# Altium schematic sheet AllInOne.SchDoc: All schematics on one sheet
size A0; Author: Guillaume Volery; Organization: HEIG-VD (iAi); Address1: HES-SO; Address2: Master of Science; Address3: in Engineering; Address4: MA-CSYEI; Revision: 2017; SheetNumber: 1; SheetTotal: 1
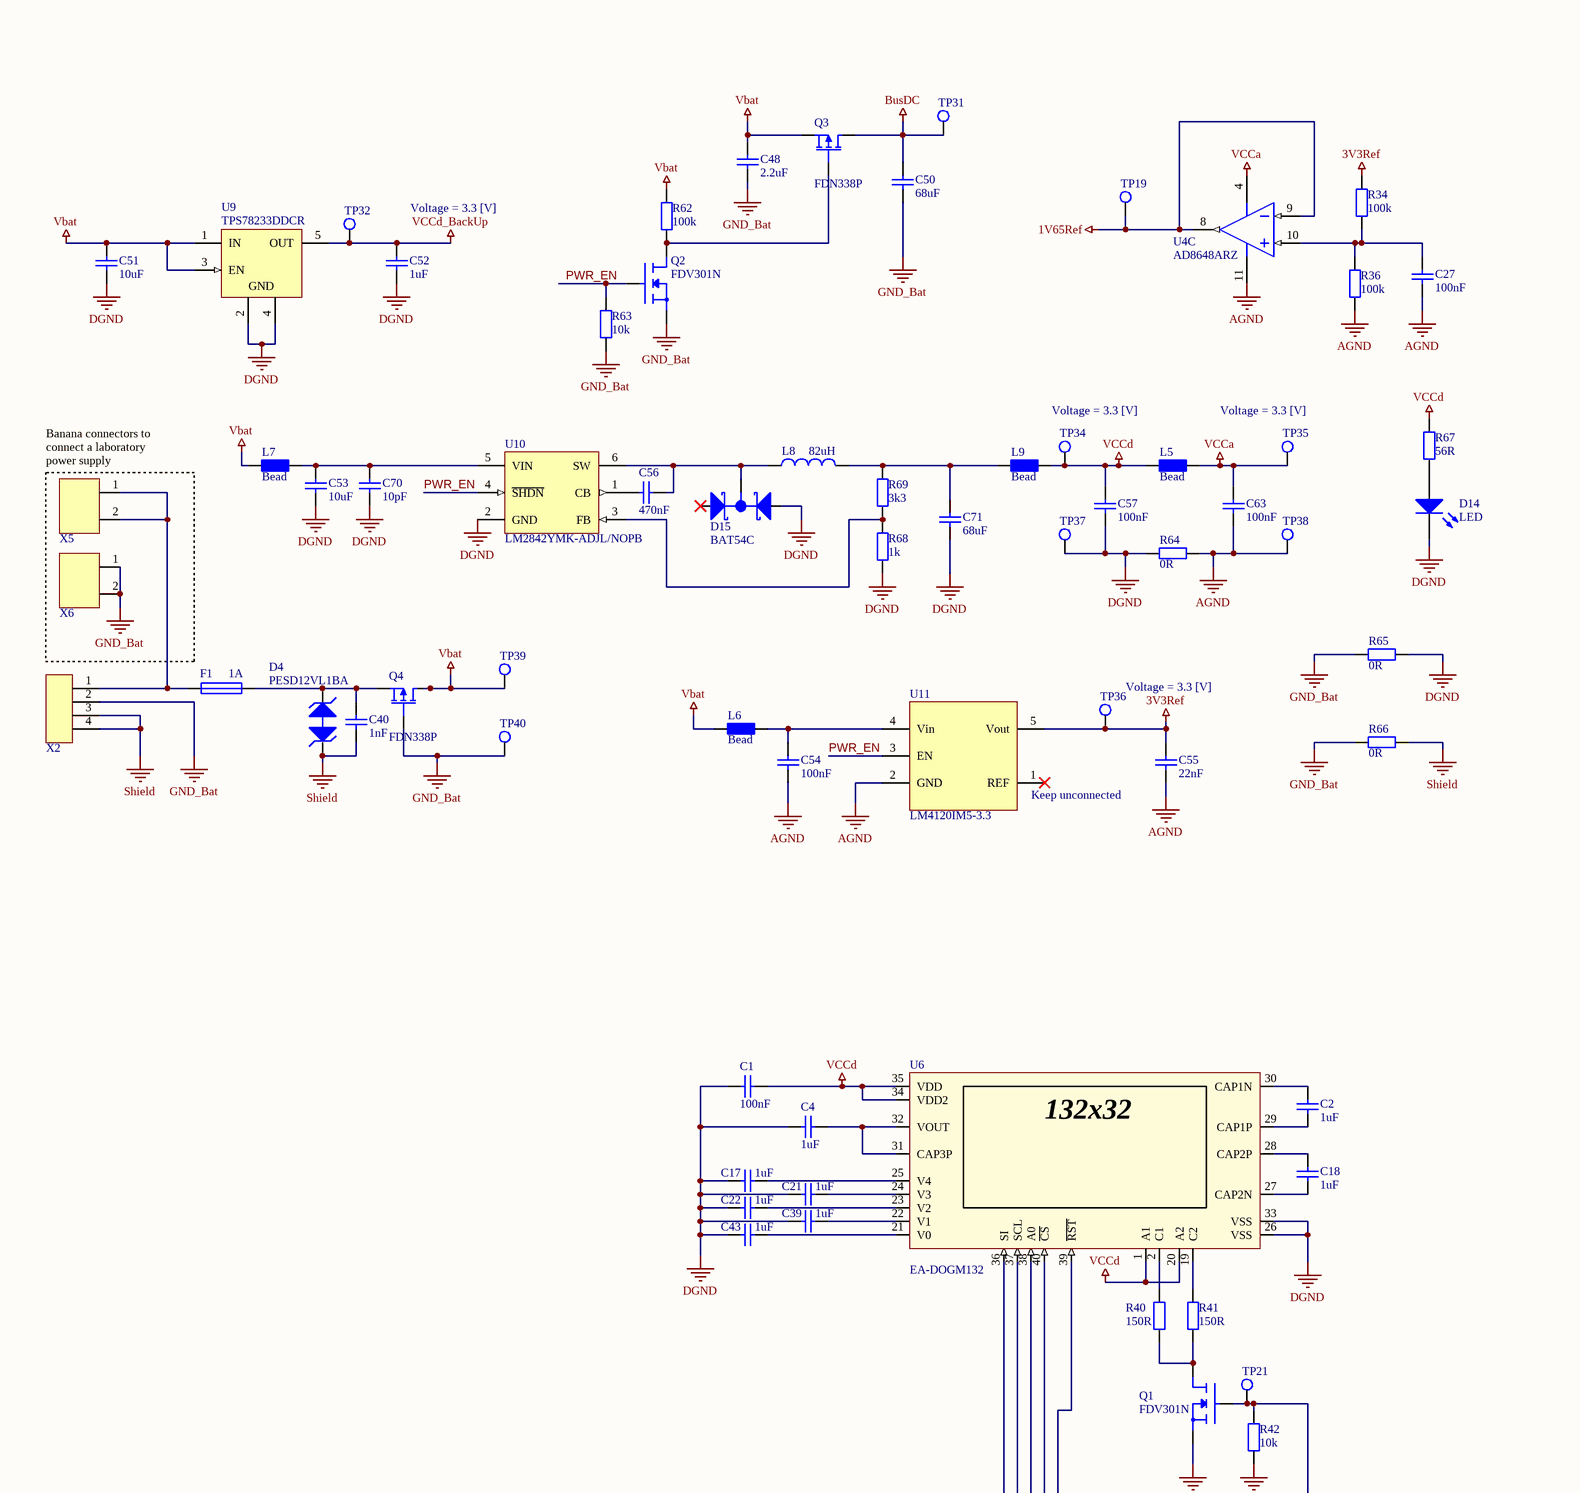
[diagram p0: AllInOne.SchDoc, top left]
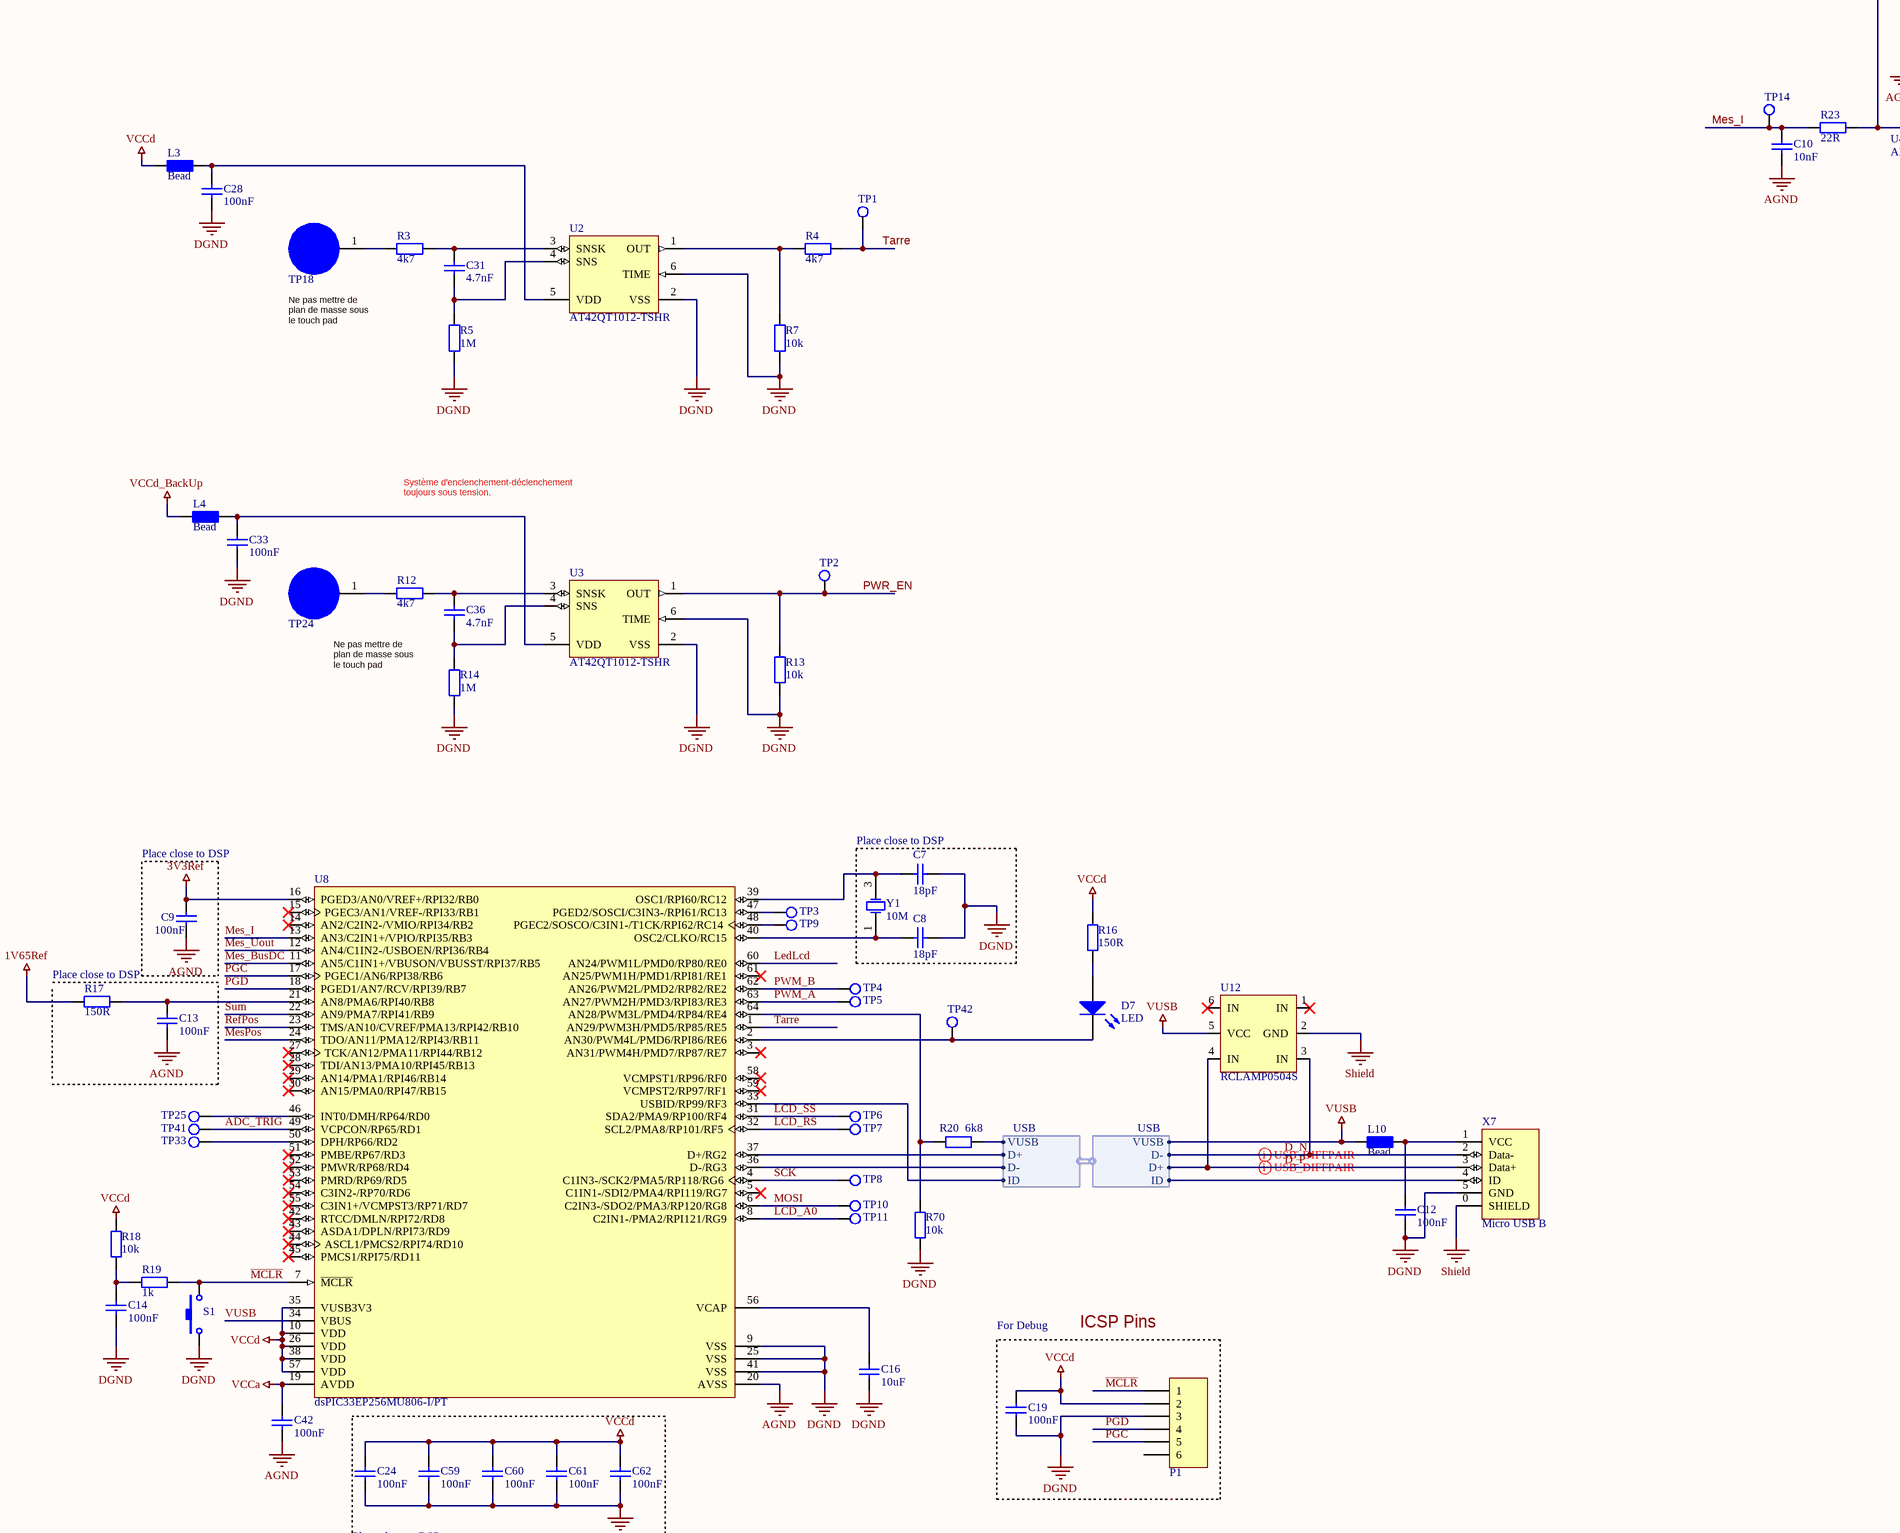
[diagram p1: AllInOne.SchDoc, top middle]
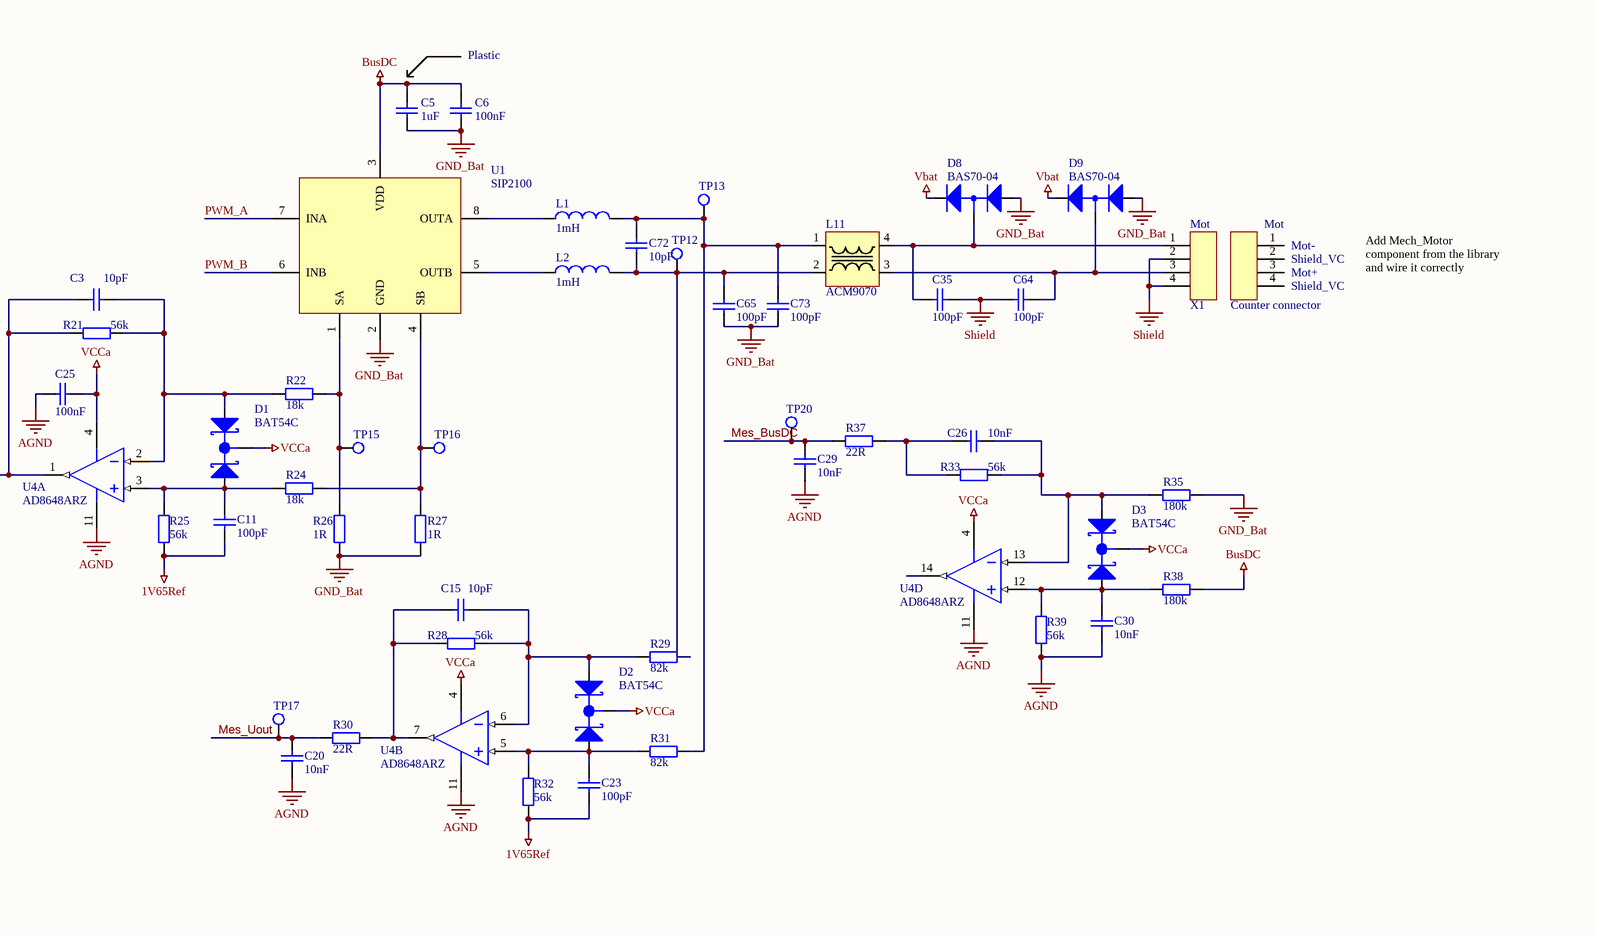
[diagram p2: AllInOne.SchDoc, top right]
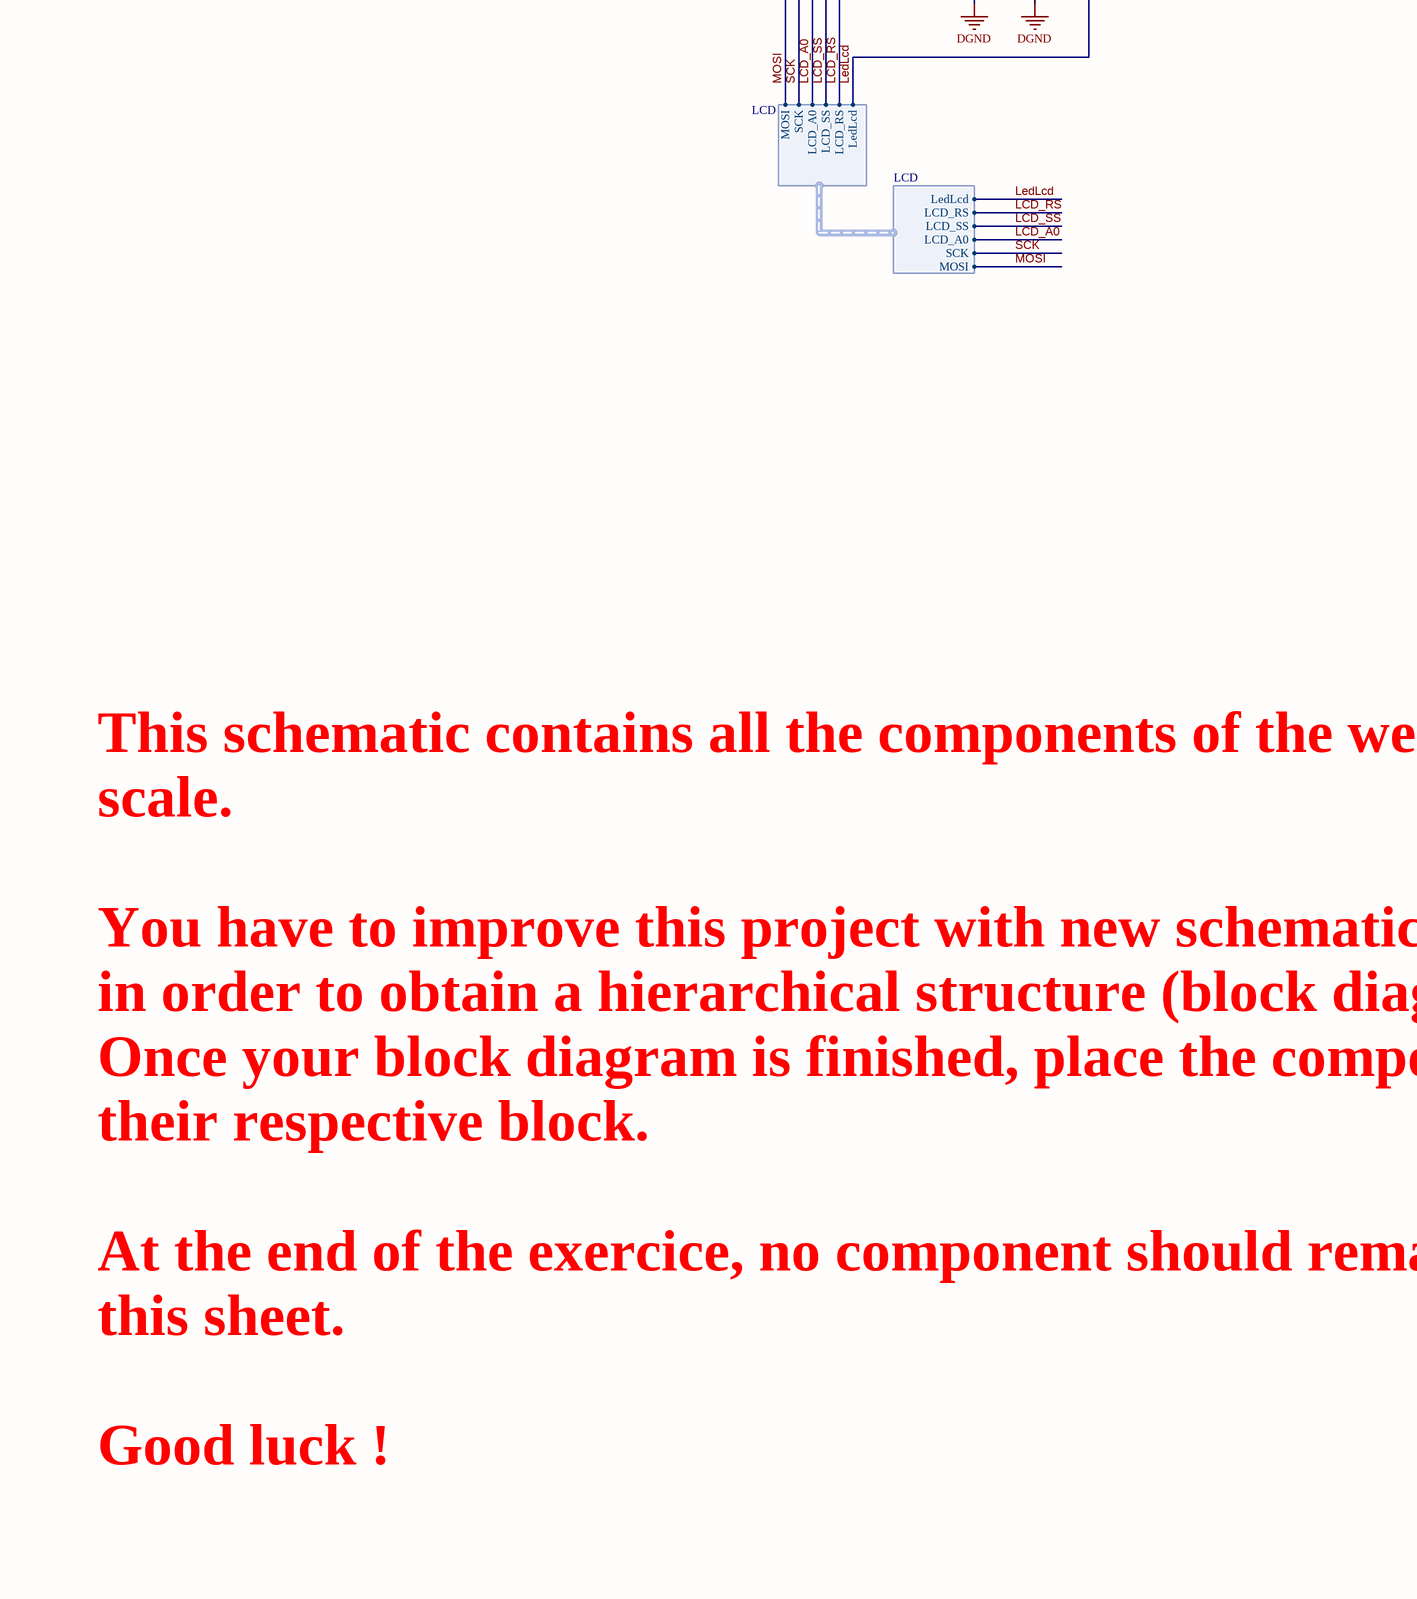
[diagram p3: AllInOne.SchDoc, bottom left]
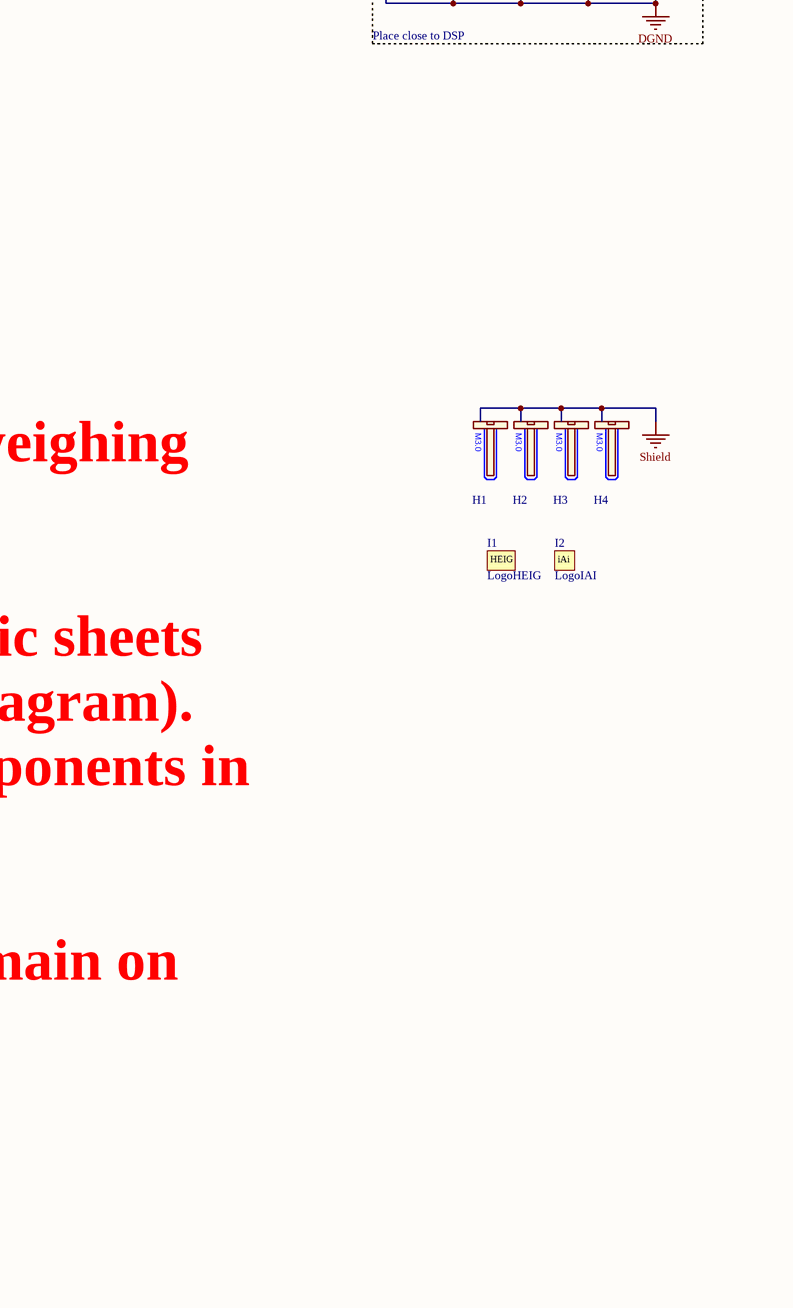
[diagram p4: AllInOne.SchDoc, bottom middle]
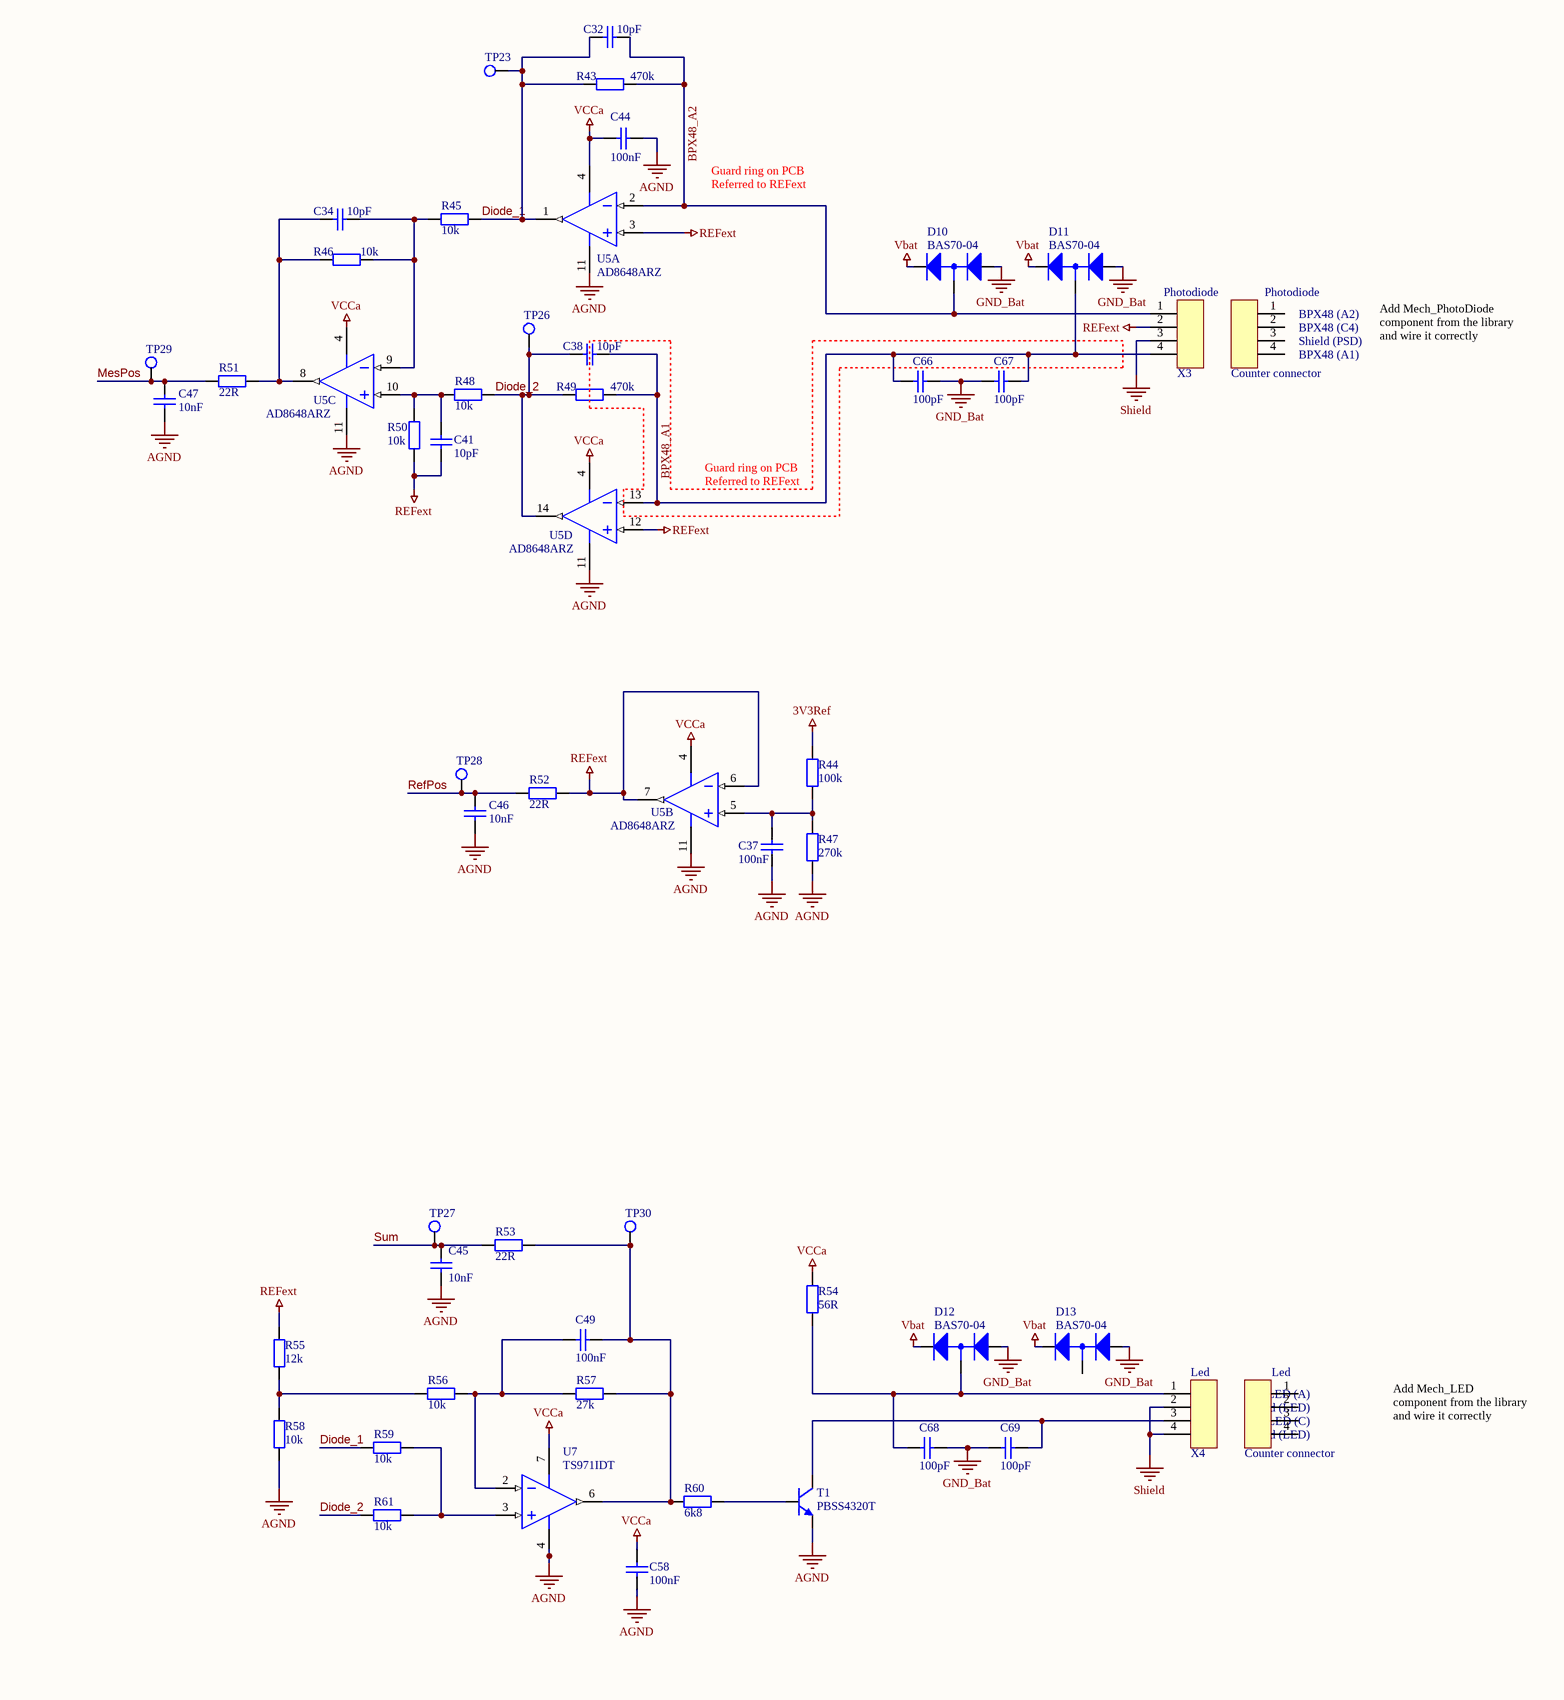
[diagram p5: AllInOne.SchDoc, bottom right]

## Parts
C1  100nF  [CAPC2012N]
C2  1uF  [CAPC2012N]
C3  10pF  [CAPC2012N]
C4  1uF  [CAPC2012N]
C5  1uF  [CAP2824]
C6  100nF  [CAPC2012N]
C7  18pF  [CAPC2012N]
C8  18pF  [CAPC2012N]
C9  100nF  [CAPC2012N]
C10  10nF  [CAPC2012N]
C11  100pF  [CAPC2012N]
C12  100nF  [CAPC2012N]
C13  100nF  [CAPC2012N]
C14  100nF  [CAPC2012N]
C15  10pF  [CAPC2012N]
C16  10uF  [CAP1206]
C17  1uF  [CAPC2012N]
C18  1uF  [CAPC2012N]
C19  100nF  [CAPC2012N]
C20  10nF  [CAPC2012N]
C21  1uF  [CAPC2012N]
C22  1uF  [CAPC2012N]
C23  100pF  [CAPC2012N]
C24  100nF  [CAPC2012N]
C25  100nF  [CAPC2012N]
C26  10nF  [CAPC2012N]
C27  100nF  [CAPC2012N]
C28  100nF  [CAPC2012N]
C29  10nF  [CAPC2012N]
C30  10nF  [CAPC2012N]
C31  4.7nF  [CAPC2012N]
C32  10pF  [CAPC2012N]
C33  100nF  [CAPC2012N]
C34  10pF  [CAPC2012N]
C35  100pF  [CAPC2012N]
C36  4.7nF  [CAPC2012N]
C37  100nF  [CAPC2012N]
C38  10pF  [CAPC2012N]
C39  1uF  [CAPC2012N]
C40  1nF  [CAPC2012N]
C41  10pF  [CAPC2012N]
C42  100nF  [CAPC2012N]
C43  1uF  [CAPC2012N]
C44  100nF  [CAPC2012N]
C45  10nF  [CAPC2012N]
C46  10nF  [CAPC2012N]
C47  10nF  [CAPC2012N]
C48  2.2uF  [CAPC2012N]
C49  100nF  [CAPC2012N]
C50  68uF  [CAP1206]
C51  10uF  [CAP1206]
C52  1uF  [CAPC2012N]
C53  10uF  [CAP1206]
C54  100nF  [CAPC2012N]
C55  22nF  [CAPC2012N]
C56  470nF  [CAPC2012N]
C57  100nF  [CAPC2012N]
C58  100nF  [CAPC2012N]
C59  100nF  [CAPC2012N]
C60  100nF  [CAPC2012N]
C61  100nF  [CAPC2012N]
C62  100nF  [CAPC2012N]
C63  100nF  [CAPC2012N]
C64  100pF  [CAPC2012N]
C65  100pF  [CAPC2012N]
C66  100pF  [CAPC2012N]
C67  100pF  [CAPC2012N]
C68  100pF  [CAPC2012N]
C69  100pF  [CAPC2012N]
C70  10pF  [CAPC2012N]
C71  68uF  [CAP1206]
C72  10pF  [CAPC2012N]
C73  100pF  [CAPC2012N]
D1  BAT54C  [SOT23-3N]
D2  BAT54C  [SOT23-3N]
D3  BAT54C  [SOT23-3N]
D4  PESD12VL1BA  [SOD323]
D7  LED  [LED2012N]
D8  BAS70-04  [SOT23-3N]
D9  BAS70-04  [SOT23-3N]
D10  BAS70-04  [SOT23-3N]
D11  BAS70-04  [SOT23-3N]
D12  BAS70-04  [SOT23-3N]
D13  BAS70-04  [SOT23-3N]
D14  LED  [LED2012N]
D15  BAT54C  [SOT23-3N]
F1  1A  [RESC2012N]
H1  Mhole M3  [MHOLE_M3.0]  (value not drawn)
H2  Mhole M3  [MHOLE_M3.0]  (value not drawn)
H3  Mhole M3  [MHOLE_M3.0]  (value not drawn)
H4  Mhole M3  [MHOLE_M3.0]  (value not drawn)
I1  LogoHEIG  [LOGO HEIG-VD_TOP/solder TOP]
I2  LogoIAI  [LOGO_IAI_TOP]
L1  1mH  [B82477G4]
L2  1mH  [B82477G4]
L3  Bead  [RESC2012N]
L4  Bead  [RESC2012N]
L5  Bead  [RESC2012N]
L6  Bead  [RESC2012N]
L7  Bead  [RESC2012N]
L8  82uH  [SRR1260A-820MC]
L9  Bead  [RESC2012N]
L10  Bead  [RESC2012N]
L11  ACM9070  [ACM9070]
P1  Connector  [HEADER_6]  (value not drawn)
Q1  FDV301N  [SOT23-3N]
Q2  FDV301N  [SOT23-3N]
Q3  FDN338P  [SOT23-3N]
Q4  FDN338P  [SOT23-3N]
R3  4k7  [RESC2012N]
R4  4k7  [RESC2012N]
R5  1M  [RESC2012N]
R7  10k  [RESC2012N]
R12  4k7  [RESC2012N]
R13  10k  [RESC2012N]
R14  1M  [RESC2012N]
R16  150R  [RESC2012N]
R17  150R  [RESC2012N]
R18  10k  [RESC2012N]
R19  1k  [RESC2012N]
R20  6k8  [RESC2012N]
R21  56k  [RESC2012N]
R22  18k  [RESC2012N]
R23  22R  [RESC2012N]
R24  18k  [RESC2012N]
R25  56k  [RESC2012N]
R26  1R  [RESC2012N]
R27  1R  [RESC2012N]
R28  56k  [RESC2012N]
R29  82k  [RESC2012N]
R30  22R  [RESC2012N]
R31  82k  [RESC2012N]
R32  56k  [RESC2012N]
R33  56k  [RESC2012N]
R34  100k  [RESC2012N]
R35  180k  [RESC2012N]
R36  100k  [RESC2012N]
R37  22R  [RESC2012N]
R38  180k  [RESC2012N]
R39  56k  [RESC2012N]
R40  150R  [RESC2012N]
R41  150R  [RESC2012N]
R42  10k  [RESC2012N]
R43  470k  [RESC2012N]
R44  100k  [RESC2012N]
R45  10k  [RESC2012N]
R46  10k  [RESC2012N]
R47  270k  [RESC2012N]
R48  10k  [RESC2012N]
R49  470k  [RESC2012N]
R50  10k  [RESC2012N]
R51  22R  [RESC2012N]
R52  22R  [RESC2012N]
R53  22R  [RESC2012N]
R54  56R  [RESC2012N]
R55  12k  [RESC2012N]
R56  10k  [RESC2012N]
R57  27k  [RESC2012N]
R58  10k  [RESC2012N]
R59  10k  [RESC2012N]
R60  6k8  [RESC2012N]
R61  10k  [RESC2012N]
R62  100k  [RESC2012N]
R63  10k  [RESC2012N]
R64  0R  [RESC2012N]
R65  0R  [RESC2012N]
R66  0R  [RESC2012N]
R67  56R  [RESC2012N]
R68  1k  [RESC2012N]
R69  3k3  [RESC2012N]
R70  10k  [RESC2012N]
S1  SW PTS810  [SW PTS810]  (value not drawn)
T1  PBSS4320T  [SOT23-3N]
TP1  TP  [Testpoint]  (value not drawn)
TP2  TP  [Testpoint]  (value not drawn)
TP3  TP  [Testpoint]  (value not drawn)
TP4  TP  [Testpoint]  (value not drawn)
TP5  TP  [Testpoint]  (value not drawn)
TP6  TP  [Testpoint]  (value not drawn)
TP7  TP  [Testpoint]  (value not drawn)
TP8  TP  [Testpoint]  (value not drawn)
TP9  TP  [Testpoint]  (value not drawn)
TP10  TP  [Testpoint]  (value not drawn)
TP11  TP  [Testpoint]  (value not drawn)
TP12  TP  [Testpoint]  (value not drawn)
TP13  TP  [Testpoint]  (value not drawn)
TP14  TP  [Testpoint]  (value not drawn)
TP15  TP  [Testpoint]  (value not drawn)
TP16  TP  [Testpoint]  (value not drawn)
TP17  TP  [Testpoint]  (value not drawn)
TP18  TouchPad10mm  [TouchPad10mm]  (value not drawn)
TP19  TP  [Testpoint]  (value not drawn)
TP20  TP  [Testpoint]  (value not drawn)
TP21  TP  [Testpoint]  (value not drawn)
TP23  TP  [Testpoint]  (value not drawn)
TP24  TouchPad10mm  [TouchPad10mm]  (value not drawn)
TP25  TP  [Testpoint]  (value not drawn)
TP26  TP  [Testpoint]  (value not drawn)
TP27  TP  [Testpoint]  (value not drawn)
TP28  TP  [Testpoint]  (value not drawn)
TP29  TP  [Testpoint]  (value not drawn)
TP30  TP  [Testpoint]  (value not drawn)
TP31  TP  [Testpoint]  (value not drawn)
TP32  TP  [Testpoint]  (value not drawn)
TP33  TP  [Testpoint]  (value not drawn)
TP34  TP  [Testpoint]  (value not drawn)
TP35  TP  [Testpoint]  (value not drawn)
TP36  TP  [Testpoint]  (value not drawn)
TP37  TP  [Testpoint]  (value not drawn)
TP38  TP  [Testpoint]  (value not drawn)
TP39  TP  [Testpoint]  (value not drawn)
TP40  TP  [Testpoint]  (value not drawn)
TP41  TP  [Testpoint]  (value not drawn)
TP42  TP  [Testpoint]  (value not drawn)
U1  SIP2100  [SOIC8]
U2  AT42QT1012-TSHR  [SOT-23-6]
U3  AT42QT1012-TSHR  [SOT-23-6]
U4  AD8648ARZ  [ADI-R-14_M]  (parts A,B,C,D of 4)
U5  AD8648ARZ  [ADI-R-14_M]  (parts A,B,C,D of 4)
U6  EA-DOGM132  [EA_DOGM132_WITH_BACKLIGHT]
U7  TS971IDT  [SOIC8]
U8  dsPIC33EP256MU806-I/PT  [TQFP64]
U9  TPS78233DDCR  [SOT-23-5]
U10  LM2842YMK-ADJL/NOPB  [SOT-23-6]
U11  LM4120IM5-3.3  [SOT-23-5]
U12  RCLAMP0504S  [SOT-23-6]
X1  MicroMatch4p  [MicroMatch4p]  (value not drawn)
X2  MicroMatch4p  [MicroMatch4p]  (value not drawn)
X3  MicroMatch4p  [MicroMatch4p]  (value not drawn)
X4  MicroMatch4p  [MicroMatch4p]  (value not drawn)
X5  Fiche Banane Rouge 4mm  [BANANE]  (value not drawn)
X6  Fiche Banane Noire 4mm  [BANANE]  (value not drawn)
X7  Micro USB B  [Micro_USB_ZX62-B-5PA(33)]
Y1  value 10M  [CRYSTAL_ABMM]  (hidden comment: XTAL)
Y2  Counter connector  (no BOM)
Y3  Counter connector  (no BOM)
Y4  Counter connector  (no BOM)

## Blocks framed on the sheet
Place close to DSP: C9
Place close to DSP: C7 C8 Y1
ICSP Pins: C19 P1

## Harnesses
LCD: LCD_RS, LCD_SS, MOSI, SCK, LedLcd, LCD_A0
USB: VUSB, D-, D+, ID

## Nets
1V65Ref: C11.1 C23.1 R17.1 R25.1 R32.1 TP19.1 U4.8(OUT_C) U4.9(-IN_C)
3V3Ref: C9.2 C55.2 R34.2 R44.2 TP36.1 U8.16(PGED3/AN0/VREF+/RPI32/RB0) U11.5(Vout)
AGND: C9.1 C10.1 C13.1 C20.1 C25.2 C27.1 C29.1 C30.1 C37.1 C42.1 C44.1 C45.1 C46.1 C47.1 C54.1 C55.1 C58.1 C63.1 R36.1 R39.1 R47.1 R58.1 R64.2 T1.2(E) TP38.1 U4.11(-V) U5.11(-V) U7.4(V-) U8.20(AVSS) U11.2(GND)
BusDC: C5.2 C6.2 C50.2 Q3.3(D) R38.2 TP31.1 U1.3(VDD)
DGND: C1.1 C4.1 C7.2 C8.2 C12.1 C14.1 C16.1 C17.1 C19.1 C21.1 C22.1 C24.1 C28.1 C33.1 C39.1 C43.1 C51.1 C52.1 C53.1 C57.1 C59.1 C60.1 C61.1 C62.1 C70.1 C71.1 D14.2(K) D15.2(A2) P1.3 Q1.2(S) R5.1 R7.1 R13.1 R14.1 R42.1 R64.1 R65.2 R68.2 R70.1 S1.1 TP37.1 U2.2(VSS) U2.6(TIME) U3.2(VSS) U3.6(TIME) U6.26(VSS) U6.33(VSS) U8.9(VSS) U8.25(VSS) U8.41(VSS) U9.2(GND) U9.4(GND) U10.2(GND) X7.5(GND)
GND_Bat: C5.1 C6.1 C48.1 C50.1 C65.1 C66.2 C67.1 C68.2 C69.1 C73.1 D8.1(A) D9.1(A) D10.1(A) D11.1(A) D12.1(A) D13.1(A) Q2.2(S) Q4.1(G) R26.1 R27.1 R35.2 R63.1 R65.1 R66.1 TP40.1 U1.2(GND) X2.2 X6.1 X6.2
REFext: C41.1 R50.1 R52.2 R55.2 U5.3(+IN_A) U5.6(-IN_B) U5.7(OUT_B) U5.12(+IN_D) X3.2
Shield: C35.2 C40.1 C64.1 D4.1(K1) H1.1(S) H2.1(S) H3.1(S) H4.1(S) R66.2 U12.2(GND) X1.2 X1.4 X2.3 X2.4 X3.3 X4.2 X4.4 X7.0(SHIELD)
Vbat: C48.2 C51.2 D8.2(K) D9.2(K) D10.2(K) D11.2(K) D12.2(K) D13.2(K) L6.1 L7.1 Q3.2(S) Q4.3(D) R62.2 TP39.1 U9.1(IN) U9.3(EN)
VCCa: C25.1 C42.2 C44.2 C58.2 C63.2 D1.3(K) D2.3(K) D3.3(K) L5.2 R54.2 TP35.1 U4.4(+V) U5.4(+V) U7.7(V+) U8.19(AVDD)
VCCd: C1.2 C19.2 C24.2 C57.2 C59.2 C60.2 C61.2 C62.2 L3.1 L5.1 L9.2 P1.2 R16.2 R18.2 R67.2 TP34.1 U6.1(A1) U6.20(A2) U6.34(VDD2) U6.35(VDD) U8.10(VDD) U8.26(VDD) U8.35(VUSB3V3) U8.38(VDD) U8.57(VDD)
VCCd_BackUp: C52.2 L4.1 TP32.1 U9.5(OUT)
VUSB: L10.2 R20.2 U8.34(VBUS) U12.5(VCC) ; harness USB.VUSB
~{MCLR}: P1.1 R19.2 S1.3 U8.7(~{MCLR})
ADC_TRIG: TP41.1 U8.49(VCPCON/RP65/RD1)
BPX48_A1: C38.2 C66.1 C67.2 D11.3(A/K) R49.2 U5.13(-IN_D) X3.4
BPX48_A2: C32.2 D10.3(A/K) R43.2 U5.2(-IN_A) X3.1
D_N: U8.36(D-/RG3) U12.3(IN) X7.2(Data-) ; harness USB.D-
D_P: U8.37(D+/RG2) U12.4(IN) X7.3(Data+) ; harness USB.D+
Diode_1: C32.1 R43.1 R45.2 R59.1 TP23.1 U5.1(OUT_A)
Diode_2: C38.1 R48.2 R49.1 R61.1 TP26.1 U5.14(OUT_D)
LCD_A0: TP11.1 U6.38(A0) U8.8(C2IN1-/PMA2/RPI121/RG9) ; harness LCD.LCD_A0
LCD_RS: TP7.1 U6.39(~{RST}) U8.32(SCL2/PMA8/RP101/RF5) ; harness LCD.LCD_RS
LCD_SS: TP6.1 U6.40(~{CS}) U8.31(SDA2/PMA9/RP100/RF4) ; harness LCD.LCD_SS
LedLcd: Q1.1(G) R42.2 TP21.1 U8.60(AN24/PWM1L/PMD0/RP80/RE0) ; harness LCD.LedLcd
Mes_BusDC: C29.2 R37.1 TP20.1 U8.11(AN5/C1IN1+/VBUSON/VBUSST/RPI37/RB5)
Mes_I: C10.2 R23.1 TP14.1 U8.13(AN3/C2IN1+/VPIO/RPI35/RB3)
Mes_Uout: C20.2 R30.1 TP17.1 U8.12(AN4/C1IN2-/USBOEN/RPI36/RB4)
MesPos: C47.2 R51.1 TP29.1 U8.24(TDO/AN11/PMA12/RPI43/RB11)
MOSI: TP10.1 U6.36(SI) U8.6(C2IN3-/SDO2/PMA3/RP120/RG8) ; harness LCD.MOSI
PGC: P1.5 U8.17(PGEC1/AN6/RPI38/RB6)
PGD: P1.4 U8.18(PGED1/AN7/RCV/RPI39/RB7)
PWM_A: TP5.1 U1.7(INA) U8.63(AN27/PWM2H/PMD3/RPI83/RE3)
PWM_B: TP4.1 U1.6(INB) U8.62(AN26/PWM2L/PMD2/RP82/RE2)
PWR_EN: Q2.1(G) R13.2 R63.2 TP2.1 U3.1(OUT) U10.4(~{SHDN}) U11.3(EN)
RefPos: C46.2 R52.1 TP28.1 U8.23(TMS/AN10/CVREF/PMA13/RPI42/RB10)
SCK: TP8.1 U6.37(SCL) U8.4(C1IN3-/SCK2/PMA5/RP118/RG6) ; harness LCD.SCK
Sum: C45.2 R53.1 TP27.1 U8.22(AN9/PMA7/RPI41/RB9)
Tarre: R4.2 TP1.1 U8.1(AN29/PWM3H/PMD5/RP85/RE5)
NetC2_1: C2.1 U6.29(CAP1P)
NetC2_2: C2.2 U6.30(CAP1N)
NetC3_1: C3.1 R21.1 R23.2 U4.1(OUT_A)
NetC3_2: C3.2 D1.1(A1) R21.2 R22.1 U4.2(-IN_A)
NetC4_2: C4.2 U6.31(CAP3P) U6.32(VOUT)
NetC7_1: C7.1 U8.39(OSC1/RPI60/RC12) Y1.3(OSC2)
NetC8_1: C8.1 U8.40(OSC2/CLKO/RC15) Y1.1(OSC1)
NetC11_2: C11.2 D1.2(A2) R24.1 R25.2 U4.3(+IN_A)
NetC12_2: C12.2 L10.1 X7.1(VCC)
NetC13_2: C13.2 R17.2 U8.21(AN8/PMA6/RPI40/RB8)
NetC14_2: C14.2 R18.1 R19.1
NetC15_1: C15.1 R28.1 R30.2 U4.7(OUT_B)
NetC15_2: C15.2 D2.1(A1) R28.2 R29.1 U4.6(-IN_B)
NetC16_2: C16.2 U8.56(VCAP)
NetC17_2: C17.2 U6.25(V4)
NetC18_1: C18.1 U6.27(CAP2N)
NetC18_2: C18.2 U6.28(CAP2P)
NetC21_2: C21.2 U6.24(V3)
NetC22_2: C22.2 U6.23(V2)
NetC23_2: C23.2 D2.2(A2) R31.1 R32.2 U4.5(+IN_B)
NetC26_1: C26.1 D3.1(A1) R33.2 R35.1 U4.13(-IN_D)
NetC26_2: C26.2 R33.1 R37.2
NetC27_2: C27.2 R34.1 R36.2 U4.10(+IN_C)
NetC28_2: C28.2 L3.2 U2.5(VDD)
NetC30_2: C30.2 D3.2(A2) R38.1 R39.2 U4.12(+IN_D)
NetC31_1: C31.1 R5.2 U2.4(SNS)
NetC31_2: C31.2 R3.2 U2.3(SNSK)
NetC33_2: C33.2 L4.2 U3.5(VDD)
NetC34_1: C34.1 R46.1 R51.2 U5.8(OUT_C)
NetC34_2: C34.2 R45.1 R46.2 U5.9(-IN_C)
NetC35_1: C35.1 D8.3(A/K) L11.4 X1.1
NetC36_1: C36.1 R14.2 U3.4(SNS)
NetC36_2: C36.2 R12.2 U3.3(SNSK)
NetC37_2: C37.2 R44.1 R47.2 U5.5(+IN_B)
NetC39_2: C39.2 U6.22(V1)
NetC40_2: C40.2 D4.2(K2) F1.2 Q4.2(S)
NetC41_2: C41.2 R48.1 R50.2 U5.10(+IN_C)
NetC43_2: C43.2 U6.21(V0)
NetC49_1: C49.1 R56.2 R57.1 U7.2(IN-)
NetC49_2: C49.2 R53.2 R57.2 R60.1 TP30.1 U7.6(OUT)
NetC53_2: C53.2 C70.2 L7.2 U10.5(VIN)
NetC54_2: C54.2 L6.2 U11.4(Vin)
NetC56_1: C56.1 U10.1(CB)
NetC56_2: C56.2 D15.3(K) L8.1 U10.6(SW)
NetC64_2: C64.2 D9.3(A/K) L11.3 X1.3
NetC65_2: C65.2 C72.1 L2.2 L11.2 R29.2 TP12.1
NetC68_1: C68.1 D12.3(A/K) R54.1 X4.1
NetC69_2: C69.2 T1.3(C) X4.3
NetC71_2: C71.2 L8.2 L9.1 R69.2
NetC72_2: C72.2 C73.2 L1.2 L11.1 R31.2 TP13.1
NetD7_1: D7.1(A) R16.1
NetD7_2: D7.2(K) TP42.1 U8.2(AN30/PWM4L/PMD6/RPI86/RE6)
NetD14_1: D14.1(A) R67.1
NetF1_1: F1.1 X2.1 X5.1 X5.2
NetL1_1: L1.1 U1.8(OUTA)
NetL2_1: L2.1 U1.5(OUTB)
NetQ1_3: Q1.3(D) R40.1 R41.1
NetQ2_3: Q2.3(D) Q3.1(G) R62.1
NetR3_1: R3.1 TP18.1
NetR4_1: R4.1 R7.2 U2.1(OUT)
NetR12_1: R12.1 TP24.1
NetR20_1: R20.1 R70.2 U8.64(AN28/PWM3L/PMD4/RP84/RE4)
NetR22_2: R22.2 R26.2 TP15.1 U1.1(SA)
NetR24_2: R24.2 R27.2 TP16.1 U1.4(SB)
NetR40_2: R40.2 U6.2(C1)
NetR41_2: R41.2 U6.19(C2)
NetR55_1: R55.1 R56.1 R58.2
NetR59_2: R59.2 R61.2 U7.3(IN+)
NetR60_2: R60.2 T1.1(B)
NetR68_1: R68.1 R69.1 U10.3(FB)
NetTP3_1: TP3.1 U8.47(PGED2/SOSCI/C3IN3-/RPI61/RC13)
NetTP9_1: TP9.1 U8.48(PGEC2/SOSCO/C3IN1-/T1CK/RPI62/RC14)
NetTP25_1: TP25.1 U8.46(INT0/DMH/RP64/RD0)
NetTP33_1: TP33.1 U8.50(DPH/RP66/RD2)
NetU8_33: U8.33(USBID/RP99/RF3) X7.4(ID) ; harness USB.ID

Not connected (* = marked no-connect by the designer): D13 3(A/K); D15 1(A1)*; P1 6; U4 14(OUT_D); U8 3(AN31/PWM4H/PMD7/RP87/RE7)* 5(C1IN1-/SDI2/PMA4/RPI119/RG7)* 14(AN2/C2IN2-/VMIO/RPI34/RB2)* 15(PGEC3/AN1/VREF-/RPI33/RB1)* 27(TCK/AN12/PMA11/RPI44/RB12)* 28(TDI/AN13/PMA10/RPI45/RB13)* 29(AN14/PMA1/RPI46/RB14)* 30(AN15/PMA0/RPI47/RB15)* 42(RTCC/DMLN/RPI72/RD8)* 43(ASDA1/DPLN/RPI73/RD9)* 44(ASCL1/PMCS2/RPI74/RD10)* 45(PMCS1/RPI75/RD11)* 51(PMBE/RP67/RD3)* 52(PMWR/RP68/RD4)* 53(PMRD/RP69/RD5)* 54(C3IN2-/RP70/RD6)* 55(C3IN1+/VCMPST3/RP71/RD7)* 58(VCMPST1/RP96/RF0)* 59(VCMPST2/RP97/RF1)* 61(AN25/PWM1H/PMD1/RPI81/RE1)*; U11 1(REF)*; U12 1(IN)* 6(IN)*; Y2 1 2 3 4; Y3 1 2 3 4; Y4 1 2 3 4

## Layout directives
differential pair: D_N, D_P

## Notes on the sheet
- (near C6) Plastic
- (near X1) Mot
- (near Y2) Mot
- (near Y2) Mot-
- (near Y2) Shield_VC
- (near Y2) Mot+
- Add Mech_Motor component from the library and wire it correctly
- Voltage = 3.3 [V]
- (near X5) Banana connectors to connect a laboratory power supply
- (near TP35) Voltage = 3.3 [V]
- Ne pas mettre de
  plan de masse sous
  le touch pad
- (near TP36) Voltage = 3.3 [V]
- Système d'enclenchement-déclenchement
  toujours sous tension.
- (near U11) Keep unconnected
- (near R17) Place close to DSP
- Guard ring on PCB
- Referred to REFext
- For Debug
- (near X3) Photodiode
- (near Y3) Photodiode
- (near Y3) BPX48 (A2)
- (near Y3) BPX48 (C4)
- (near Y3) Shield (PSD)
- (near Y3) BPX48 (A1)
- Add Mech_PhotoDiode component from the library and wire it correctly
- Place close to DSP
- (near X4) Led
- (near Y4) Led
- (near Y4) LED (C)
- (near Y4) Shield (LED)
- (near Y4) LED (A)
- Add Mech_LED component from the library and wire it correctly
- This schematic contains all the components of the weighing scale.
  You have to improve this project with new schematic sheets in order to obtain a hierarchical structure (block diagram). Once your block diagram is finished, place the components in their respective block.
  At the end of the exercice, no component should remain on this sheet.
  Good luck !
- Title
- Size:
- Date:
- File:
- A0
- Number:
- Time:
- Revision:
- Sheet
- of
- (in symbol DOGM_132-5) 132x32
- (in symbol LogoHEIG) HEIG
- (in symbol LogoIAI) iAi
- (in symbol M3) M3.0

## Library data of the parts
C1 C6 C9 C12-C14 C19 C24 C25 C27 C28 C33 C37 C42 C44 C49 C54 C57-C63 = Cap_100nF: Capacitor; Value: 100nF; Supplier 1: Digi-Key; Supplier Part Number 1: 478-1395-1-ND
C2 C4 C17 C18 C21 C22 C39 C43 C52 = Cap_1uF: Capacitor; Value: 1uF; Supplier 1: Digi-Key; Supplier Part Number 1: 490-10743-1-ND
C3 C15 C32 C34 C38 C41 C70 C72 = Cap_10pF: Capacitor; Value: 10pF; Supplier 1: Digi-Key; Supplier Part Number 1: 311-1099-1-ND
C5 = Cap_1uF_Plastic: Capacitor; Value: 1uF; Supplier 1: Digi-Key; Supplier Part Number 1: 399-6416-1-ND
C7 C8 = Cap_18pF: Capacitor; Value: 18pF; Supplier 1: Digi-Key; Supplier Part Number 1: 311-1102-1-ND
C10 C20 C26 C29 C30 C45-C47 = Cap_10nF: Capacitor; Value: 10nF; Supplier 1: Digi-Key; Supplier Part Number 1: 311-1136-1-ND
C11 C23 C35 C64-C69 C73 = Cap_100pF: Capacitor; Value: 100pF; Supplier 1: Digi-Key; Supplier Part Number 1: 399-1122-1-ND
C16 C51 C53 = Cap_10uF: Capacitor; Value: 10uF; Supplier 1: Digi-Key; Supplier Part Number 1: 445-7886-1-ND
C31 C36 = Cap_4.7nF: Capacitor; Value: 4.7nF; Supplier 1: Digi-Key; Supplier Part Number 1: 311-1431-1-ND
C40 = Cap_1nF: Capacitor; Value: 1nF; Supplier 1: Digi-Key; Supplier Part Number 1: 311-1127-1-ND
C48 = Cap_2.2uF: Capacitor; Value: 2.2uF; Supplier 1: Digi-Key; Supplier Part Number 1: 490-10744-1-ND
C50 C71 = Cap_68uF: Capacitor; Value: 68uF; Supplier 1: Digi-Key; Supplier Part Number 1: 445-11687-1-ND
C55 = Cap_22nF: Capacitor; Value: 22nF; Supplier 1: Digi-Key; Supplier Part Number 1: 311-1138-1-ND
C56 = Cap_470nF: Capacitor; Value: 470nF; Supplier 1: Digi-Key; Supplier Part Number 1: 399-8100-1-ND
D7 = Led_Rouge_0805: Supplier 1: Digi-Key; Supplier Part Number 1: 475-1415-1-ND
D14 = LED_Green_0805: Supplier 1: Digi-Key; Supplier Part Number 1: 475-1410-1-ND
F1 = Fuse_1A: MFU0805FF01000P100; Supplier 1: Digi-Key; Supplier Part Number 1: MFU08051.00CT-ND; Value: 1A
H1-H4 = M3: Value: Mhole M3
L1 L2 = B82477G4105M: Supplier 1: Digi-Key; Supplier Part Number 1: 495-1820-1-ND; Value: 1mH
L8 = SRR1260A-820M: Value: 82uH; Supplier 1: Digi-Key; Supplier Part Number 1: SRR1260A-820MCT-ND
P1 = Header 6: Header, 6-Pin; Supplier Part Number 1: S9015E-03-ND; Supplier 1: Digi-Key
Q3 Q4 = FDN338P: MOSFet P; Supplier 1: Digi-Key; Supplier Part Number 1: FDN338PCT-ND; Value: FDN338P
R3 R4 R12 = Res_4k7: Resistor; Value: 4k7; Supplier 1: Digi-Key; Supplier Part Number 1: 311-4.70KCRCT-ND
R5 R14 = Res_1M: Resistor; Value: 1M; Supplier 1: Digi-Key; Supplier Part Number 1: 311-1.00MCRCT-ND
R7 R13 R18 R42 R45 R46 R48 R50 R56 R58 R59 R61 R63 R70 = Res_10k: Resistor; Value: 10k; Supplier 1: Digi-Key; Supplier Part Number 1: 311-10.0KCRCT-ND
R16 R17 R40 R41 = Res_150R: Resistor; Value: 150R; Supplier 1: Digi-Key; Supplier Part Number 1: 311-150CRCT-ND
R19 = Res__1k: Resistor; Value: 1k; Supplier 1: Digi-Key; Supplier Part Number 1: 311-1.00KCRCT-ND
R20 R60 = Res_6k8: Resistor; Value: 6k8; Supplier 1: Digi-Key; Supplier Part Number 1: 311-6.80KCRCT-ND
R21 R25 R28 R32 R33 R39 = Res_56k: Resistor; Value: 56k; Supplier 1: Digi-Key; Supplier Part Number 1: 311-56.0KCRCT-ND
R22 R24 = Res_18k: Resistor; Value: 18k; Supplier 1: Digi-Key; Supplier Part Number 1: 311-18.0KCRCT-ND
R23 R30 R37 R51-R53 = Res_22R: Resistor; Value: 22R; Supplier 1: Digi-Key; Supplier Part Number 1: 311-22.0CRCT-ND
R26 R27 = Res_1R: Resistor; Value: 1R; Supplier 1: Digi-Key; Supplier Part Number 1: CRT0805-CY-1R00ELFCT-ND
R29 R31 = Res_82k: Resistor; Value: 82k; Supplier 1: Digi-Key; Supplier Part Number 1: 311-82.0KCRCT-ND
R34 R36 R44 R62 = Res_100k: Resistor; Value: 100k; Supplier 1: Digi-Key; Supplier Part Number 1: 311-100KCRCT-ND
R35 R38 = Res_180k: Resistor; Value: 180k; Supplier 1: Digi-Key; Supplier Part Number 1: 311-180KCRCT-ND
R43 R49 = Res_470k: Resistor; Value: 470k; Supplier 1: Digi-Key; Supplier Part Number 1: 311-470KCRCT-ND
R47 = Res_270k: Resistor; Value: 270k; Supplier 1: Digi-Key; Supplier Part Number 1: 311-270KCRCT-ND
R54 R67 = Res_56R: Resistor; Value: 56R; Supplier 1: Digi-Key; Supplier Part Number 1: 311-56.0CRCT-ND
R55 = Res_12k: Resistor; Value: 12k; Supplier 1: Digi-Key; Supplier Part Number 1: 311-12.0KCRCT-ND
R57 = Res_27k: Resistor; Value: 27k; Supplier 1: Digi-Key; Supplier Part Number 1: 311-27.0KCRCT-ND
R64-R66 = Res_0R: Resistor; Value: 0R; Supplier 1: Digi-Key; Supplier Part Number 1: 311-0.0ARCT-ND
R68 = Res_1k: Resistor; Value: 1k; Supplier 1: Digi-Key; Supplier Part Number 1: 311-1.00KCRCT-ND
R69 = Res_3k3: Resistor; Value: 3k3; Supplier 1: Digi-Key; Supplier Part Number 1: 311-3.30KCRCT-ND
S1 = SW PTS810: Switch; Supplier 1: Digi-Key; Supplier Part Number 1: CKN10502CT-ND
TP1-TP17 TP19-TP21 TP23 TP25-TP42 = TP: =Value; Supplier 1: Digi-Key; Supplier Part Number 1: 36-5006-ND
U2 U3 = AT42QT1012-TSHR: One-channel Toggle-mode Touch Sensor IC with Power Management Functions, -40° to +85° C, 6-pin SOT23; DatasheetVersion: revD, Aug-2010; PackageVersion: revA, Jun-2008; PackageReference: 6ST1; PackageDescription: 6-Lead, 2.90 x 1.60 mm Plastic Small Outline Package (SOT23); Code_JEDEC: MO-178-AB; Code_IPC: SOT26A-6; ComponentLink1Description: Manufacturer URL; ComponentLink1URL: http://www.atmel.com/; ComponentLink2Description: Datasheet; ComponentLink2URL: http://www.atmel.com/Images/doc9543.pdf; Supplier 1: Digi-Key; Supplier Part Number 1: AT42QT1012-TSHRCT-ND
U4 U5 = AD8648ARZ: Quad Channel Wide Bandwidth Operational Amplifier, 22 MHz BW, 12 V/us SR, Industrial, 14-pin SOIC (R-14), Tube; Generic Part Number: AD8648; Manufacturer: Analog Devices; Amplifiers Per Package: 4; Automotive Qualified: Yes; Input Bias Current: 200fA; Input Offset Voltage: 700uV; Iq/Amp: 2mA; Slew Rate: 12V/us; Small Signal Bandwidth: 22MHz; V Span Max: 5.5V; V Span Min: 2.7V; DatasheetVersion: Rev. D; PackageVersion: 060606-A; PackageReference: R-14; PackageDescription: 14-Pin Standard Small Outline Package, Body 8.65 x 3.9 mm, Pitch 1.27 mm; Mounting Technology: Surface Mount; Code_JEDEC: MS-012-AB; PartNumber: AD8648ARZ; ComponentLink1Description: Manufacturer URL; ComponentLink1URL: http://www.analog.com/en/index.html; ComponentLink2Description: Datasheet; ComponentLink2URL: http://www.analog.com/static/imported-files/data_sheets/AD8646_8647_8648.pdf; ComponentLink3Description: Package Specification; ComponentLink3URL: http://www.analog.com/static/imported-files/packages/PKG_PDF/SOIC_Narrow%20(R)/R_14.pdf; Supplier 1: Digi-Key; Supplier Part Number 1: AD8648ARZ-ND
U6 = DOGM_132-5: Chip On Glass Graphic LCD; Value: EA-DOGM132
U8 = dsPIC33EP256MU806-I/PT: 16-Bit Digital Signal Processor; Supplier 1: Digi-Key; Supplier Part Number 1: DSPIC33EP256MU806-I/PT-ND; Value: DSPIC33EP256MU806-I/PT
U9 = TPS78233DDCR: Single Output LDO, 150 mA, Fixed 3.3 V Output, 2.2 to 5.5 V Input, with 0.5 uA Quiescent Current, 5-pin SOT (DDC), -40 to 125 degC, Green (RoHS & no Sb/Br); Manufacturer: Texas Instruments; Accuracy(%): 3; Dynamic Voltage Scaling: TRUE; Fixed Output Options(V): 3.3; Iout(Max)(A): 0.15; Iq(Typ)(mA): 0.0005; Rating: Catalog; SubFamily: Single Channel LDO; Vdo(Typ)(mV): 130; Vin(Max)(V): 5.5; Vin(Min)(V): 2.2; DatasheetVersion: SBVS115B; PackageVersion: 4204403-2/E; PackageReference: DDC5; PackageDescription: 5-Pin Plastic Small Outline, Body 2.9 x 1.6 mm, 0.95 mm Pitch; Supplier 1: Digi-Key; Supplier Part Number 1: 296-24059-1-ND; Eco-Plan: Green (RoHS & no Sb/Br); Vout Adj(Max)(V): 3.3; Vout Adj(Min)(V): 3.3; Mounting Technology: Surface Mount; Code_JEDEC: MO-193; PartNumber: TPS78233DDCR; ComponentLink1Description: Manufacturer URL; ComponentLink1URL: http://www.ti.com/; ComponentLink2Description: Datasheet; ComponentLink2URL: http://www.ti.com/general/docs/lit/getliterature.tsp?genericPartNumber=TPS78233&fileType=pdf; ComponentLink3Description: Package Specification; ComponentLink3URL: http://www.ti.com/litv/pdf/mpds123d
U10 = LM2842YMK-ADJL/NOPB: 600 mA up to 42V Input Step-Down DC/DC Regulator, Thin 6-pin SOT23, Pb-Free, 1000 Reel; Supplier 1: Digi-Key; Supplier Part Number 1: LM2842YMK-ADJL/NOPBCT-ND
U12 = RCLAMP0504S.TCT: Supplier 1: Digi-Key; Supplier Part Number 1: RCLAMP0504SCT-ND
X7 = Micro_USB_ZX62-B-5PA(33): Supplier 1: Digi-Key; Supplier Part Number 1: H125270CT-ND
Y1 = XTAL: Crystal Oscillator; Supplier 1: Digi-Key; Supplier Part Number 1: 535-9150-1-ND
Y2-Y4 = MicroMatch4p_Header: Counter connector of MicroMatch4p; Supplier 1: Digi-Key; Supplier Part Number 1: A107022CT-ND
D1-D3 D15 = BAT54C: Supplier 1: Digi-Key; Supplier Part Number 1: BAT54CLT1GOSCT-ND
D4 = PESD12VL1BA: Supplier 1: Digi-Key; Supplier Part Number 1: 568-4022-1-ND
D8-D13 = BAS70-04: Supplier 1: Digi-Key; Supplier Part Number 1: BAS70-04-FDICT-ND
L3-L7 L9 L10 = Bead: Value: Bead; Supplier 1: Digi-Key; Supplier Part Number 1: 240-2399-1-ND
L11 = ACM9070: Supplier 1: Digi-Key; Supplier Part Number 1: 445-2216-1-ND
Q1 Q2 = FDV301N: Value: FDV301N; Supplier 1: Digi-Key; Supplier Part Number 1: FDV301NCT-ND
T1 = PBSS4320T: Supplier 1: Digi-Key; Supplier Part Number 1: 568-4157-1-ND
U1 = SIP2100: Supplier 1: Digi-Key; Supplier Part Number 1: SIP2100DY-T1-GE3CT-ND
U7 = TS971IDT: Supplier 1: Digi-Key; Supplier Part Number 1: 497-6780-1-ND
U11 = LM4120IM5-3.3: Supplier 1: Digi-Key; Supplier Part Number 1: LM4120IM5-3.3/NOPBCT-ND
X1-X4 = MicroMatch4p: Supplier 1: Digi-Key; Supplier Part Number 1: A107022CT-ND
X5 = Fiche Banane Rouge 4mm: Supplier 1: Farnell; Supplier Part Number 1: 1698982
X6 = Fiche Banane Noire 4mm: Supplier 1: Farnell; Supplier Part Number 1: 1698983